# EAGLE design AnemometroWifi (EAGLE 7.3.0)
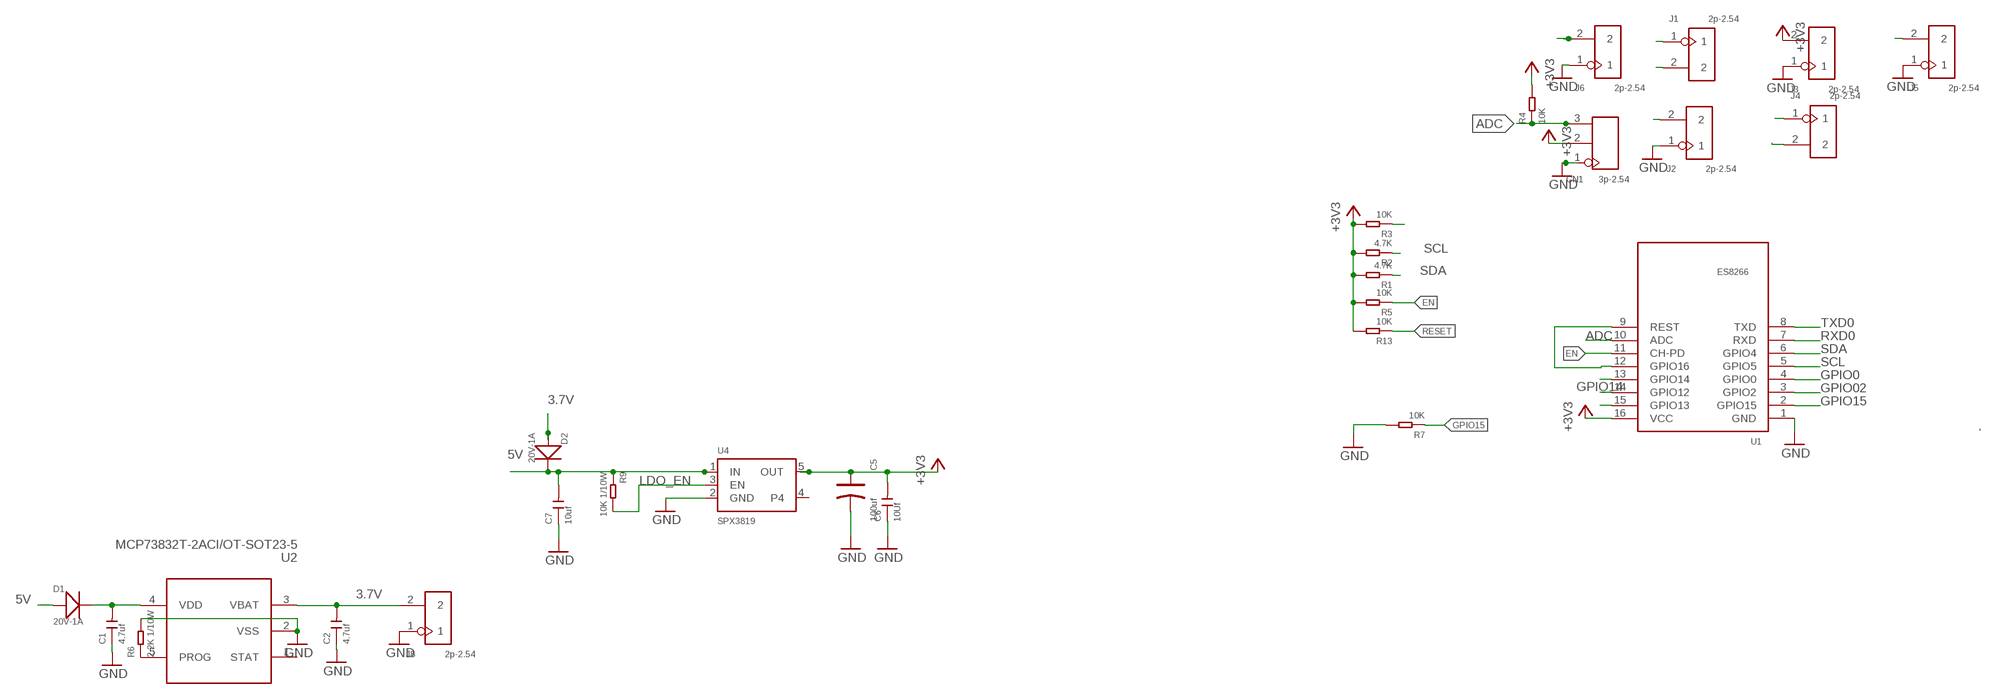
[diagram p0: schematic, sheet 1]

## Parts
C1  4.7uf  CERAMIC-4.7UF-10V-10%-X5R(0603)  [C0603]
C2  4.7uf  CERAMIC-4.7UF-10V-10%-X5R(0603)  [C0603]
C5  100uf  TANTALUM-SMD-100UF-10V(AVX-B)  [AVX-B]
C6  10Uf  CERAMIC-100NF-50V-10%-X7R(0603)  [C0603]
C7  10uf  CERAMIC-10UF-25V-10%-X5R(0805)  [C0805]
CN1  3p-2.54  DIP-BLACK-MALE-HEADER-VERT(3P-2.54)  [H3-2.54]
D1  20V-1A  SMD-DIODE-SCHOTTKY-20V-1A(SOD-123)  [SOD-123]
D2  20V-1A  SMD-DIODE-SCHOTTKY-20V-1A(SOD-123)  [SOD-123]
J1  2p-2.54  DIP-BLACK-FEMALE-HEADER-VERT(2P-2.54)  [H2-2.54]
J2  2p-2.54  DIP-BLACK-FEMALE-HEADER-VERT(2P-2.54)  [H2-2.54]
J3  2p-2.54  DIP-BLACK-FEMALE-HEADER-VERT(2P-2.54)  [H2-2.54]
J4  2p-2.54  DIP-BLACK-FEMALE-HEADER-VERT(2P-2.54)  [H2-2.54]
J5  2p-2.54  DIP-BLACK-FEMALE-HEADER-VERT(2P-2.54)  [H2-2.54]
J6  2p-2.54  DIP-BLACK-MALE-HEADER-VERT(2P-2.54)  [H2-2.54]
J8  2p-2.54  DIP-BLACK-FEMALE-HEADER-VERT(2P-2.54)  [H2-2.54]
R1  4.7K  SMD-RES-4.7K-5%-1/10W(0603)  [R0603]
R2  4.7K  SMD-RES-4.7K-5%-1/10W(0603)  [R0603]
R3  10K  SMD-RES-0R-5%-1/10W(0603)  [R0603]
R4  10K  SMD-RES-0R-5%-1/10W(0603)  [R0603]
R5  10K  SMD-RES-0R-5%-1/10W(0603)  [R0603]
R6  2.2K 1/10W  SMD-RES-2.2K-1%-1/10W(0603)  [R0603]
R7  10K  SMD-RES-0R-5%-1/10W(0603)  [R0603]
R9  10K 1/10W  SMD-RES-10K-5%-1/10W(0603)  [R0603]
R13  10K  SMD-RES-0R-5%-1/10W(0603)  [R0603]
U1  ES8266  MOUDLE-WIFI-ESP8266-AKX(16P-24X16MM)  [LGA16-2.0-24X16MM]
U2  MCP73832T-2ACI/OT-SOT23-5  PMIC-MCP73832T-2ACI/OT(SOT23-5)  [SOT-23-5]
U4  SPX3819  VREG_SOT23-5  [SOT23-5]

## Nets
3.7V: C2.2 D2.+ J8.2 U2.3(VBAT)
5V: C7.2 D1.+ D2.- J5.2 R9.1 U4.1(IN)
+3V3: C5.+ C6.2 CN1.2 J3.2 R1.2 R2.2 R3.2 R4.2 R5.2 R13.2 U1.16(VCC) U4.5(OUT)
ADC: CN1.3 R4.1 U1.10(ADC)
EN: R5.1 U1.11(CH-PD)
GND: C1.1 C2.1 C5.- C6.1 C7.1 CN1.1 J2.1 J3.1 J5.1 J6.1 J8.1 R6.2 R7.2 U1.1(GND) U2.2(VSS) U4.2(GND)
GPIO0: J6.2 U1.4(GPIO0)
GPIO02: U1.3(GPIO2)
GPIO12: U1.14(GPIO12)
GPIO13: U1.15(GPIO13)
GPIO14: J2.2 R3.1 U1.13(GPIO14)
GPIO15: R7.1 U1.2(GPIO15)
LDO_EN: R9.2 U4.3(EN)
N$2: R6.1 U2.5(PROG)
N$3: C1.2 D1.- U2.4(VDD)
RESET: R13.1 U1.9(REST) U1.12(GPIO16)
RXD0: J1.2 U1.7(RXD)
SCL: J4.1 R2.1 U1.5(GPIO5)
SDA: J4.2 R1.1 U1.6(GPIO4)
TXD0: J1.1 U1.8(TXD)
Unconnected: U2.1(STAT) U4.4

## Library data of the parts
C1 C2 = Seeed-OPL-Capacitor:CERAMIC-4.7UF-10V-10%-X5R(0603): 302010111; MPN: CC0603KRX5R6BB475
C5 = Seeed-OPL-Capacitor:TANTALUM-SMD-100UF-10V(AVX-B): 302020015; MPN: TAJB107M010#NJ
C6 = Seeed-OPL-Capacitor:CERAMIC-100NF-50V-10%-X7R(0603): 302010138; MPN: CC0603KRX7R9BB104; VALUE: 100nf
C7 = Seeed-OPL-Capacitor:CERAMIC-10UF-25V-10%-X5R(0805): 302010178; MPN: CC0805KKX5R8BB106
CN1 = Seeed-OPL-Connector:DIP-BLACK-MALE-HEADER-VERT(3P-2.54): 320020079
D1 D2 = Seeed-OPL-Diode:SMD-DIODE-SCHOTTKY-20V-1A(SOD-123): 304020034; MPN: B5819W
J1-J5 J8 = Seeed-OPL-Connector:DIP-BLACK-FEMALE-HEADER-VERT(2P-2.54): 320030023; MPN: F185-1102A1BSYA1
J6 = Seeed-OPL-Connector:DIP-BLACK-MALE-HEADER-VERT(2P-2.54): 320020016; MPN: P125-1102A0BS116A1
R1 R2 = Seeed-OPL-Resistor:SMD-RES-4.7K-5%-1/10W(0603): 301010290; MPN: RC0603JR-074K7L
R3-R5 R7 R13 = Seeed-OPL-Resistor:SMD-RES-0R-5%-1/10W(0603): 301010292; MPN: RC0603JR-070RL; VALUE: 0R
R6 = Seeed-OPL-Resistor:SMD-RES-2.2K-1%-1/10W(0603): 301010200; MPN: RC0603FR-072K2L
R9 = Seeed-OPL-Resistor:SMD-RES-10K-5%-1/10W(0603): 301010293; MPN: RC0603JR-0710KL
U1 = Seeed-OPL-Moudle:MOUDLE-WIFI-ESP8266-AKX(16P-24X16MM): 317060011; MPN: ES8266
U2 = Seeed-OPL-ic:PMIC-MCP73832T-2ACI/OT(SOT23-5): 310030238; MPN: MCP73832T-2ACI/OT
U4 = microbuilder:VREG_SOT23-5: SOT23-5 Fixed Voltage Regulators Part Current Out V Out V In V Dropout θJA (°C/W) TJ (°C) Digikey Part No. ADP121 150mA 3.3V 3.4-5.5V 0.09V @ 150mA -- -- ADP121-AUJZ33R7CT-ND ADP121 150mA 3.0V 3.1-5.5V 0.09V @ 150mA -- -- ADP121-AUJZ30R7CT-ND ADP122 300mA 3.3V 3.4-5.5V 0.085V @ 300mA -- -- ADP122AUJZ-3.3-R7CT-ND ADP1712 300mA 3.3V 3.5-5.5V 0.17V @ 300mA -- -- ADP1712AUJZ-3.3-R7TR-ND AP7311 (Low Cost) 150mA 3.3V 3.5-6V 0.15V @ 150mA -- -- AP7311-33WG-7DICT-ND LD39015M18R 150mA 1.8V 1.9V-5.5V 0.08V @ 100mA -- -- 497-6977-1-ND LP2985A-33DBVR 150mA 3.3V 3.3-16V 0.28V @ 150mA 206 150 296-18479-1-ND MCP1824T-3302E/OT 300mA 3.3V 3.5V-6V 0.2V @ 300mA -- -- MCP1824T-3302E/OTCT-ND MIC5205-2.5YM5 TR 150mA 2.5V 2.7-16V 0.165V @ 150mA -- -- 576-1257-2-ND MIC5205-3.0YM5 TR 150mA 3.0V 3.2V-16V 0.165V @ 150mA -- -- 576-1258-2-ND MIC5205-3.3YM5 TR 150mA 3.3V 3.5V-16V 0.165V @ 150mA -- -- 576-1259-2-ND TPS780330220 150mA 3.3V+2.2V 3.6-5.5V 250mV Max -- -- 296-23332-1-ND TDA3663/N1,135 100mA 3.3V 3.5-45V 0.18V @ 50mA -- -- 568-5343-1-ND Max operating temp can be calculated using θJA, TJ (max junction temperature), and power in watts. Set the "Maximum Ambient Temperature" until it reaches TJ ("Max Junction Temperature"), which is the absolute limit for safe use of the regulator: Heat Sink Temperature Calculator <http://www.daycounter.com/Calculators/Heat-Sink-Temperature-Calculator.phtml> For example, With 12V source into a 3.3V LP2985 and a 30mA load, we are dissipating (12V-3.3V) * 0.03A = 0.261W. With a θJA of 206 °C/W, a TJ of 150°C, and 261mW we can safely use the chip without a heat sink up to 75°C (=147.1°C Junction Temperature).

## Board
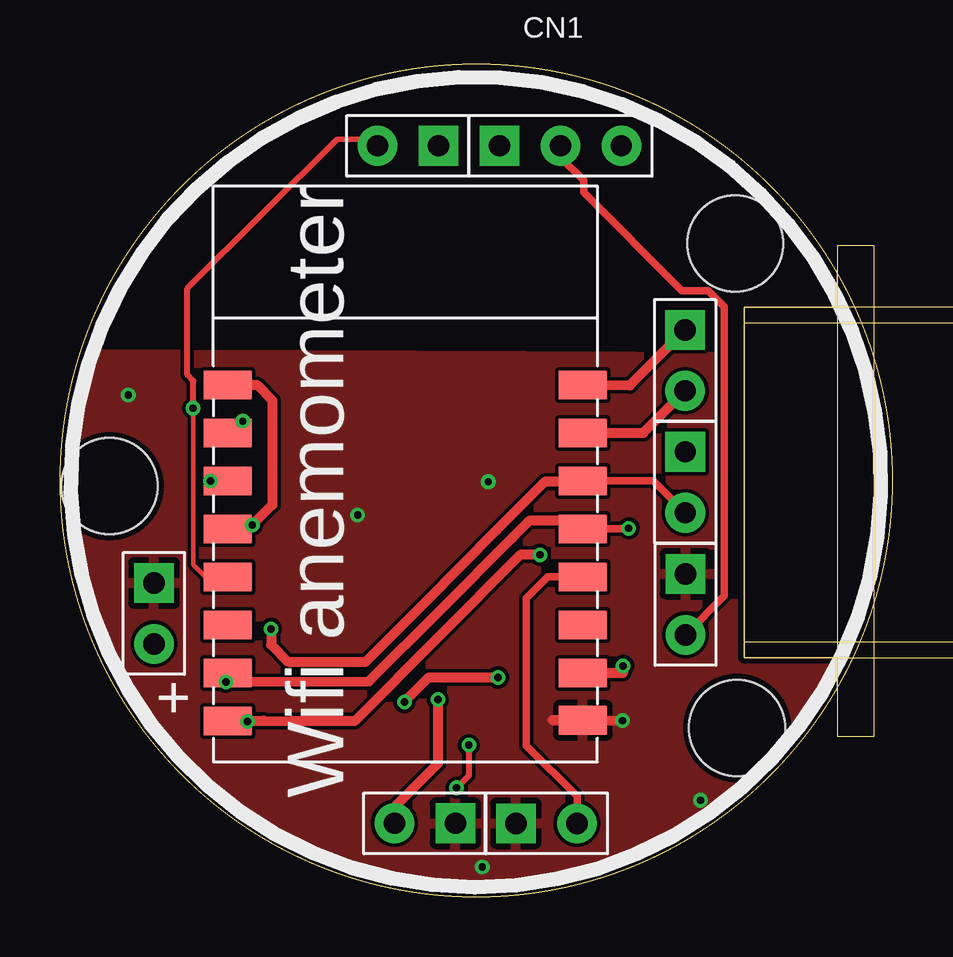
[diagram p1: board, top side]
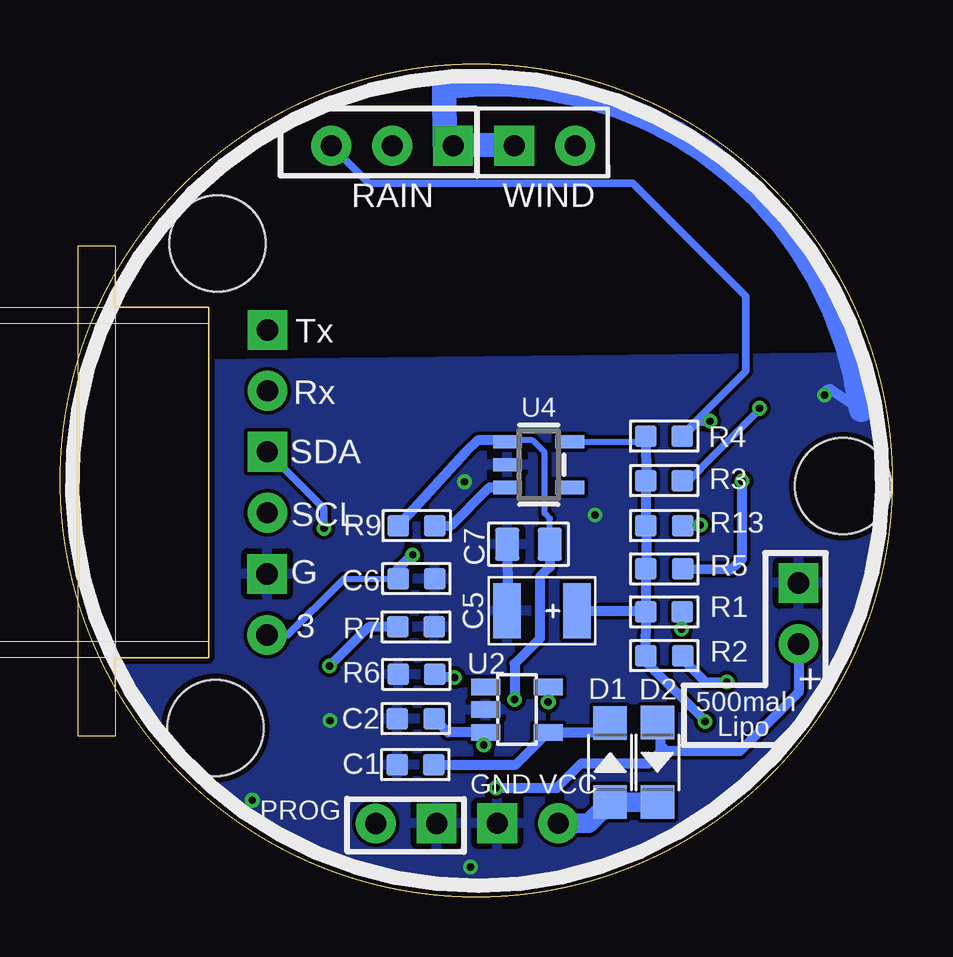
[diagram p2: board, bottom side, seen from below]

Size 34.69 x 34.69 mm. Coordinates in mm from the lower left corner, seen from the top.
Outline: 32.39,8.57 32.39,9.97 28.5,9.97 28.5,24.57 32.39,24.57 32.39,26.12
Outline: circle at 17.35,17.35 radius 17.35
Copper layers (1*16): Top 0.035mm / dielectric 1.5mm / Bottom 0.035mm
Design rules "SeeedStudio_2layer_DRU_no_angle_20140221": minimum track width 6mil, minimum drill 12mil, track to track 6mil, track to pad 6mil, pad to pad 6mil, via to via 6mil, smd to smd 0mil, copper to edge 10mil, drill to drill 10mil, minimum pad ring 10mil, minimum via ring 6mil, stop-mask expansion 2mil, vias tented up to drill 100mil, thermal gap 10mil
Holes 4 mm at 28.13,27.24 2.06,17.12 28.22,7.04
Milling: area 32.4,6.7 to 33.9,27.1; area 28.5,10.6 to 37.4,24.6; area 28.5,10 to 37.4,23.9

### Footprints (pad centres in the part's own frame; a part is rotated, then mirrored left to right if it is on the bottom)
C0603 = smd 0.889 x 0.889: 1 0,0.762; 2 0,-0.762
AVX-B = smd 1.143 x 2.286: + -1.46,0; - 1.46,0
C0805 = smd 1.397 x 1.016: 1 0,0.889; 2 0,-0.889
H3-2.54 = drill 0.889 pad 1.651 square: 1 0,2.54 | drill 0.889 pad 1.651: 2 0,0; 3 0,-2.54
SOD-123 = smd 1.397 x 1.397: + -1.651,0; - 1.651,0
H2-2.54 = drill 0.889 pad 1.651 square: 1 0,1.27 | drill 0.889 pad 1.651: 2 0,-1.27
R0603 = smd 0.889 x 0.889: 1 0,0.762; 2 0,-0.762
LGA16-2.0-24X16MM = smd 2 x 1.2: 1 7.4,-10.27; 2 7.4,-8.3; 3 7.4,-6.3; 4 7.4,-4.3; 5 7.4,-2.3; 6 7.4,-0.3; 7 7.4,1.7; 8 7.4,3.7; 9 -7.4,3.7; 10 -7.4,1.7; 11 -7.4,-0.3; 12 -7.4,-2.3; 13 -7.4,-4.3; 14 -7.4,-6.3; 15 -7.4,-8.3; 16 -7.4,-10.3
SOT-23-5 = smd 0.69 x 1.2: 1 -0.95,-1.3; 2 0,-1.3; 3 0.95,-1.3; 4 0.95,1.3; 5 -0.95,1.3
SOT23-5 = smd 0.55 x 1.2: 1 -0.95,-1.3; 2 0,-1.3; 3 0.95,-1.3; 4 0.95,1.3; 5 -0.95,1.3

### Placement (x,y rotation side)
C1  19.88,5.51 90 bottom
C2  19.87,7.43 90 bottom
C5  14.6,11.92 180 bottom
C6  19.84,13.26 270 bottom
C7  15.17,14.7 90 bottom
CN1  20.85,31.3 90 top
D1  11.77,5.61 90 bottom
D2  9.8,5.61 270 bottom
J1  26.04,22.36 0 top
J2  14.49,31.3 270 top
J3  26.06,12.19 0 top
J4  26.05,17.28 0 top
J5  15.2,3.07 270 top
J6  20.27,3.07 90 top
J8  3.92,11.81 0 top
R1  9.52,11.88 270 bottom
R2  9.51,10.06 270 bottom
R3  9.52,17.35 270 bottom
R4  9.52,19.2 270 bottom
R5  9.51,13.67 270 bottom
R6  19.84,9.27 270 bottom
R7  19.86,11.26 90 bottom
R9  19.83,15.47 90 bottom
R13  9.51,15.47 270 bottom
U1  14.39,17.63 0 top
U2  15.65,7.8 270 bottom
U4  14.75,18.01 270 bottom

### Tracks (layer width: path | path; a pad name or v marks a point on that pad's centre or on a via)
3.7V  (via drill 0.3)
  Top 0.254: v17.03,6.33 17.03,5.06 v16.53,4.55
  Bottom 0.254: U2.3 16.95,6.41 v17.03,6.33
  Bottom 0.406: U2.3 18.53,6.85 C2.2 | v16.53,4.55 13.99,4.55 12.97,5.57 10.18,5.57 9.67,6.07 9.67,6.33 | 9.67,6.33 9.67,7.13 D2.+ | J8.2 3.92,8.53 6.37,6.07 9.41,6.07 9.67,6.33
5V  (via drill 0.3)
  Top 0.406: v15.75,8.22 15.75,5.56 13.9,3.71 13.9,3.1 J5.2
  Bottom 0.254: C7.2 14.28,15.77 14.49,15.98 14.49,18.52 15,19.03 15.98,19.03 U4.1
  Bottom 0.406: C7.2 14.28,13.76 14.7,13.34 14.7,10.77 15.75,9.72 v15.75,8.22 | R9.1 17.8,18.52 17.29,19.03 16.11,19.03 U4.1
  Bottom 0.813: J5.2 12.66,3.07 D1.+ D2.-
+3V3  (via drill 0.3)
  Top 0.178: 8.79,7.34 v7.81,7.31
  Top 0.305: CN1.2 20.85,30.83 21.81,29.87 21.81,29.37 25.92,25.26 27.02,25.26 27.68,24.6 27.68,12.54 J3.2
  Top 0.406: U1.16 8.49,7.34 v7.81,7.31 9.62,7.32 12.27,7.33 19.18,14.25 v20,14.26
  Bottom 0.254: 22.86,13.26 21.02,13.26 20.72,13.57 20.62,13.67 | U4.5 10.52,18.96 R4.2
  Bottom 0.305: 22.86,13.26 23.06,13.05 25.19,10.92 J3.2
  Bottom 0.406: 10.28,15.4 R13.2 | R13.2 10.25,15.37 10.25,13.87 10.28,13.84 10.28,13.64 R5.2 10.28,11.91 R1.2 | 20.62,13.67 v20,14.26 | R1.2 10.3,10.1 R2.2 10.26,9.79 7.8,7.34 v7.81,7.31 | R4.2 10.27,17.37 R3.2 10.28,15.48 R13.2 | C5.+ 10.32,11.92 R1.2 | C6.2 20.6,13.45 20.72,13.57
ADC  (via drill 0.3)
  Top 0.406: U1.10 7.61,19.33 v7.61,19.83
  Bottom 0.305: R4.1 8.76,19.26 6.12,21.9 6.12,25.02 10.84,29.74 21.83,29.74 CN1.3
  Bottom 0.406: v7.61,19.83 8.13,19.83 R4.1
EN  (via drill 0.3)
  Top 0.406: v6.27,17.33 U1.11
  Bottom 0.406: R5.1 6.71,13.65 6.27,14.08 6.27,15.77 6.27,16.38 v6.27,17.33
GND  (via drill 0.3)
  Top 0.406: U1.1 20.52,7.36 v23.44,7.35
  Bottom 0.305: CN1.1 15.57,31.3 15.25,31.61 15.45,31.61 J2.1
  Bottom 0.406: C7.1 16.03,12.42 | 16.03,12.42 C5.- | 16.06,12.39 16.03,12.42 | 16.41,31.33 J2.1 15.86,31.42 | 2.81,20.95 v2.84,20.91 arc90 2.59,21.16 1.31,20.3
  Bottom 1.016: 16.41,31.33 18.67,31.35 18.67,33.74 arc90 1.31,20.3
  other vias: 26.68,4.03 17.59,1.25 17.84,17.3 12.4,15.92
  pour Top (isolate 0.127): 0.47,17.09 1.11,22.48 28.45,22.04 32.78,21.72 32.88,9.61 29.62,5.04 24.61,1.24 19.3,0.29 11.9,0.78 6.49,4.27 2.86,8.8 1.58,11.48 1.62,11.48
  pour Bottom (isolate 0.127): 1.22,12.3 0.41,16.97 1.14,22.48 32.89,22.15 32.34,9 27.78,3.43 24.78,1.29 21.14,0.38 15.35,0.18 11.15,1.02 7.7,3.08 4.54,6.31 2.66,9.18
  pour Bottom (isolate 0.127): 1.21,12.3 0.4,16.97 1.12,22.48 32.88,22.15 32.33,9 27.77,3.43 24.77,1.29 21.13,0.38 15.34,0.18 11.14,1.02 7.69,3.08 4.53,6.31 2.65,9.18
  pour Top (isolate 0.127): 0.54,17.25 1.17,22.64 28.58,22.5 32.85,21.88 32.95,9.77 29.69,5.2 24.68,1.4 19.37,0.45 11.97,0.94 6.56,4.43 2.93,8.96 1.65,11.64 1.69,11.64
GPIO0
  Top 0.305: U1.4 21.77,13.35 20.32,13.35 19.42,12.45 19.42,6.3 21.55,4.19 21.55,3.12 J6.2
GPIO12
  Top 0.305: 7.67,11.32 7,11.32 U1.14
GPIO14  (via drill 0.3)
  Top 0.178: U1.13 6.06,13.33 5.56,13.84 v5.55,20.36
  Top 0.254: v5.55,20.36 5.56,21.5 5.31,21.75 5.3,25.36 11.56,31.57 13.13,31.58
  Top 0.305: J2.2 13.13,31.52 13.13,31.58
  Bottom 0.305: 8.5,17.35 7.47,18.38 5.56,20.29 v5.55,20.36
  Bottom 0.406: R3.1 8.5,17.35
GPIO15  (via drill 0.3)
  Top 0.406: 23.46,9.37 v23.46,9.63 23.46,9.34 21.45,9.34 21.67,9.45 U1.2
  Bottom 0.406: R7.1 21.82,11.25 v23.46,9.63
LDO_EN
  Bottom 0.406: 16.11,17 U4.3 16.8,17.06 18.39,15.47 R9.2
N$2  (via drill 0.31)
  Top 0.406: v14.35,8.13 15.37,9.15 v18.25,9.15
  Bottom 0.406: U2.5 v14.35,8.13 | v18.25,9.15 19.02,9.15 R6.1
N$3
  Bottom 0.406: C1.2 15.69,5.51 U2.4 12.18,6.85 D1.-
RESET  (via drill 0.3)
  Top 0.406: U1.12 7.15,15.5 v8.01,15.5 8.85,16.34 8.85,20.69 8.21,21.33 U1.9
  Bottom 0.406: R13.1 8.05,15.46 v8.01,15.5
RXD0
  Top 0.406: U1.7 24.3,19.33 J1.2
SCL  (via drill 0.3)
  Top 0.305: U1.5 23.67,15.33 v23.69,15.36
  Top 0.406: v6.91,8.96 12.87,8.98 15.87,11.97 18.83,14.94 19.58,15.69 21.43,15.69 U1.5
  Bottom 0.305: v23.69,15.36 23.69,16.19 J4.1
  Bottom 0.406: R2.1 8.75,9.92 7.79,8.95 v6.91,8.96
SDA  (via drill 0.3)
  Top 0.305: U1.6 24.73,17.33 J4.2
  Top 0.406: U1.6 20.22,17.32 18.2,15.3 15.26,12.33 12.74,9.81 9.48,9.81 8.79,10.5 v8.79,11.17
  Bottom 0.406: R1.1 8.78,11.18 v8.79,11.17
TXD0
  Top 0.406: U1.8 23.75,21.32 J1.1

### Text on the board
tNames: Wifi anemometer | +
bNames: WIND | RAIN | Tx | Rx | SDA | SCL | G | 3 | + | 500mah | Lipo | GND VCC | PROG | C:/Users/Jorge Trincado/Google Drive/logoInvertido.bmp